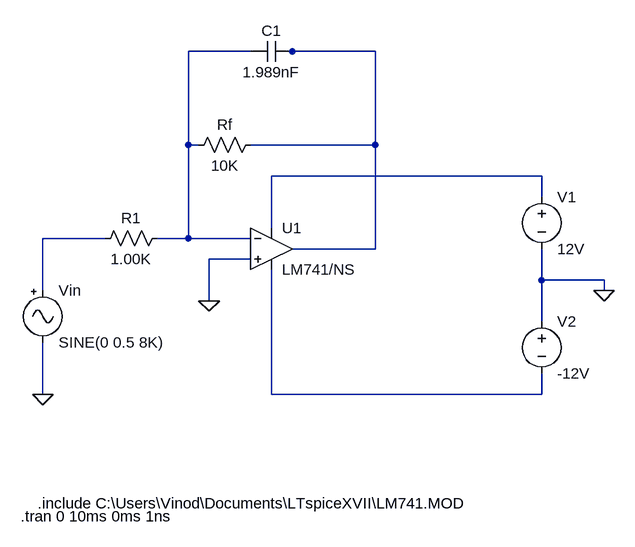
[diagram p0: schematic Differentiator.asc]
Differentiator.asc, the LTspice schematic file:
Version 4
SHEET 1 880 680
WIRE 160 -128 64 -128
WIRE 224 -128 208 -128
WIRE 352 -128 224 -128
WIRE 64 16 64 -128
WIRE 80 16 64 16
WIRE 352 16 352 -128
WIRE 352 16 160 16
WIRE 608 64 192 64
WIRE 608 96 608 64
WIRE 192 144 192 64
WIRE -64 160 -160 160
WIRE 64 160 64 16
WIRE 64 160 16 160
WIRE 160 160 64 160
WIRE 352 176 352 16
WIRE 352 176 224 176
WIRE 160 192 96 192
WIRE 608 224 608 176
WIRE 704 224 608 224
WIRE -160 240 -160 160
WIRE 704 240 704 224
WIRE 96 256 96 192
WIRE 608 288 608 224
WIRE -160 400 -160 320
WIRE 192 400 192 208
WIRE 608 400 608 368
WIRE 608 400 192 400
FLAG 704 240 0
FLAG 96 256 0
FLAG -160 400 0
SYMBOL OpAmps\\opamp2 192 112 R0
SYMATTR InstName U1
SYMATTR Value LM741/NS
SYMBOL res 32 144 R90
WINDOW 0 0 56 VBottom 2
WINDOW 3 32 56 VTop 2
SYMATTR InstName R1
SYMATTR Value 1.00K
SYMBOL res 176 0 R90
WINDOW 0 0 56 VBottom 2
WINDOW 3 32 56 VTop 2
SYMATTR InstName Rf
SYMATTR Value 10K
SYMBOL voltage 608 80 R0
SYMATTR InstName V1
SYMATTR Value 12V
SYMBOL voltage 608 272 R0
SYMATTR InstName V2
SYMATTR Value -12V
SYMBOL Misc\\signal -160 224 R0
WINDOW 123 0 0 Left 0
WINDOW 39 0 0 Left 0
SYMATTR InstName Vin
SYMATTR Value SINE(0 0.5 8K)
SYMBOL cap 224 -144 R90
WINDOW 0 0 32 VBottom 2
WINDOW 3 32 32 VTop 2
SYMATTR InstName C1
SYMATTR Value 1.989nF
TEXT -168 568 Left 2 !.include C:\\Users\\Vinod\\Documents\\LTspiceXVII\\LM741.MOD
TEXT -194 588 Left 2 !.tran 0 10ms 0ms 1ns

The netlist it stands for:
* Differentiator.asc
XU1 0 N001 N003 N005 N002 LM741/NS  ; pins In+ In- V+ V- OUT
R1 N001 N004 1.00K
Rf N002 N001 10K
V1 N003 0 12V
V2 0 N005 -12V
Vin N004 0 SINE(0 0.5 8K)
C1 N002 N001 1.989nF
.include C:\Users\Vinod\Documents\LTspiceXVII\LM741.MOD
.tran 0 10ms 0ms 1ns
.backanno
.end